# EasyEDA Pro project evenVCO.eprj, board PCB1
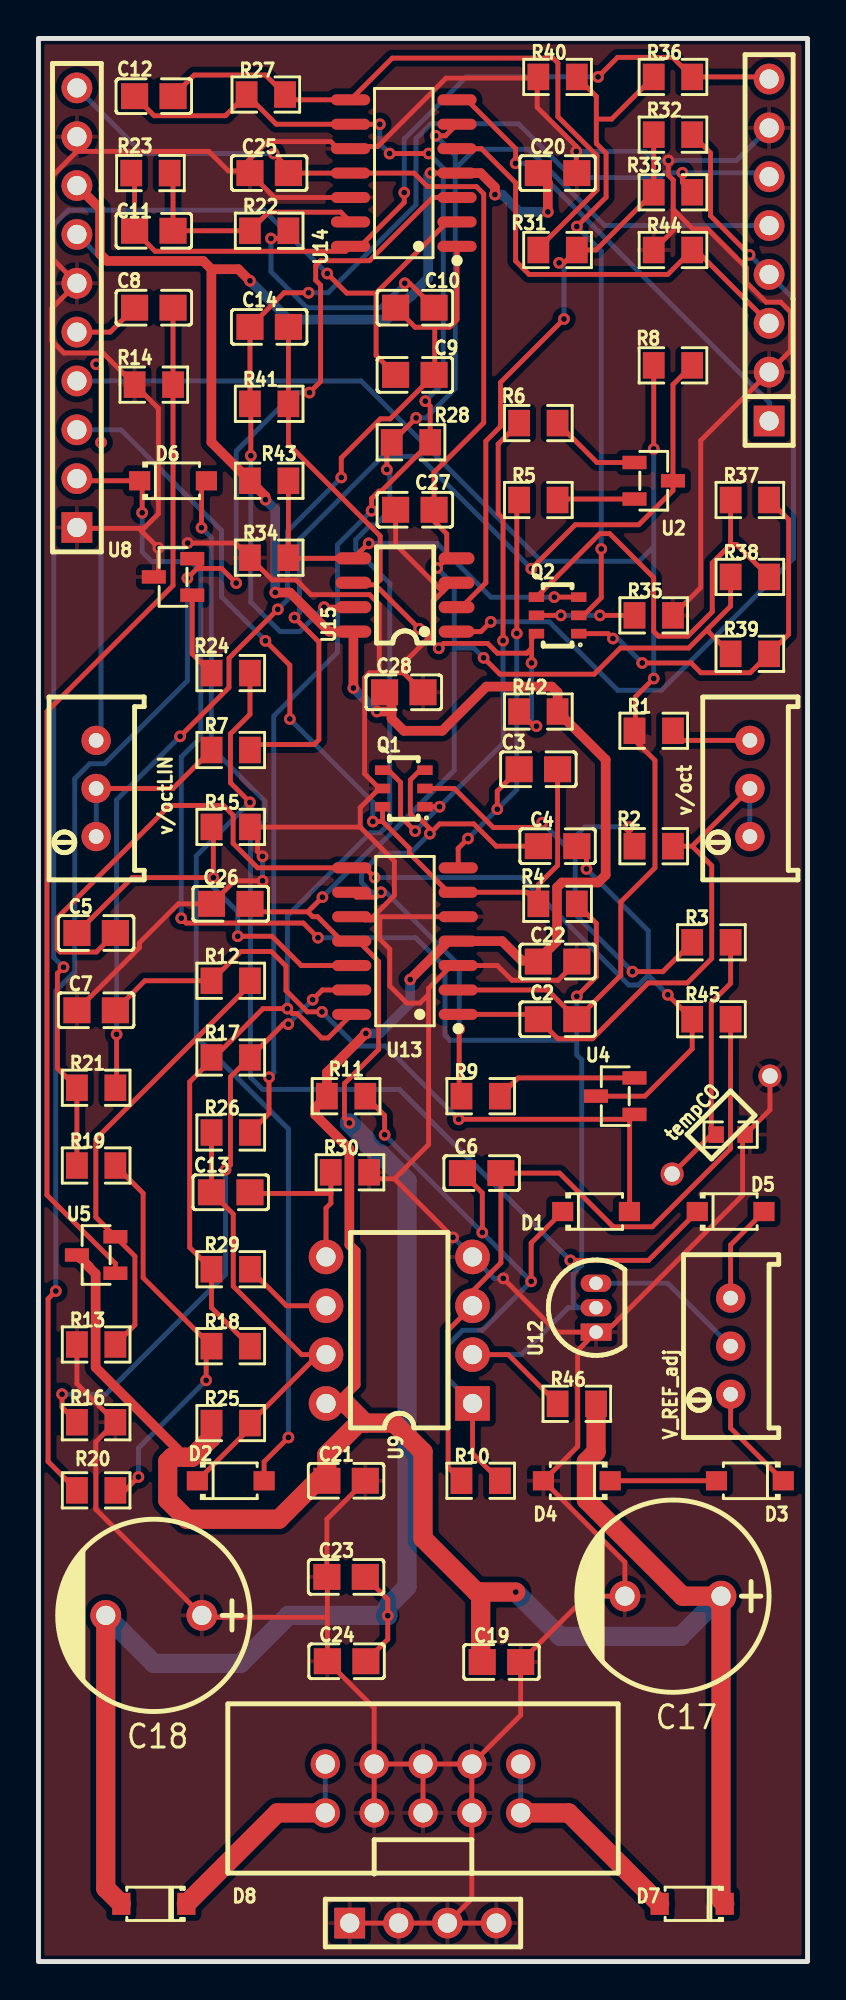
[diagram p6: board, top side]
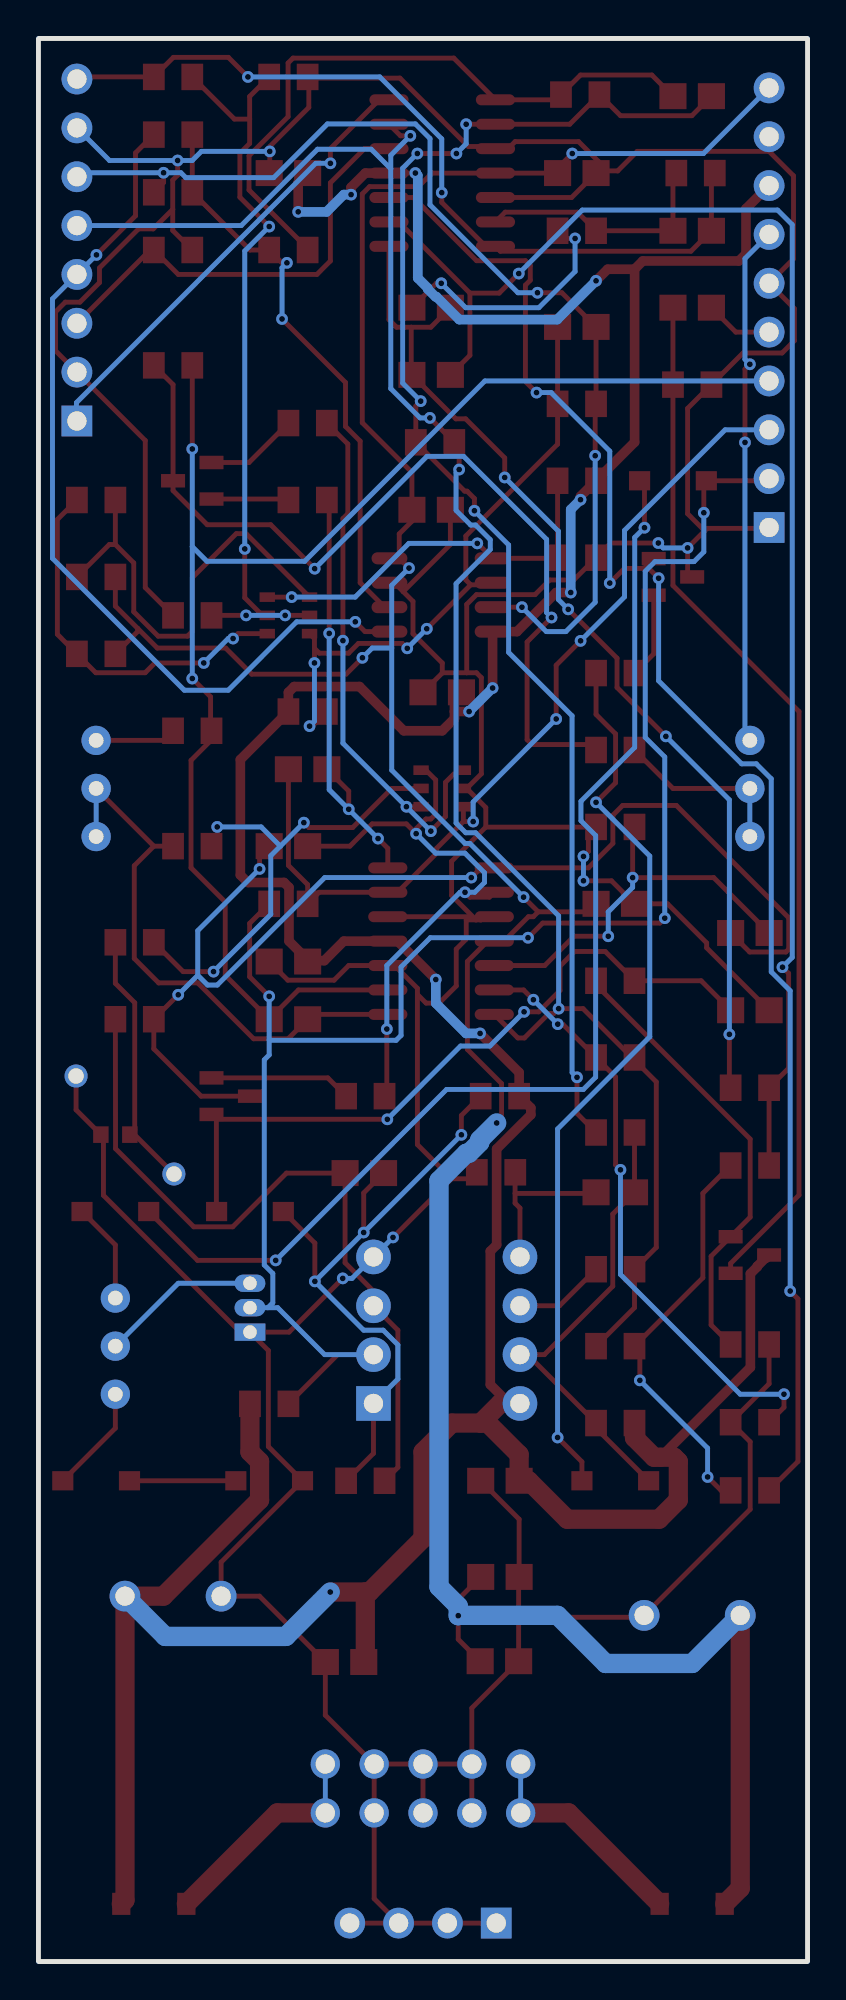
[diagram p7: board, bottom side, seen from below]

Outline 40 x 100 mm; copper layers: Top Layer, Bottom Layer. Coordinates in mm from the lower left corner of the outline.
Outline path: rectangle 0,100 40,0
Stack: Top Layer 0.035mm / Dielectric1 1.51mm FR4 er 4.5 / Bottom Layer 0.035mm

## Design rules (mm)
template: JLCPCB Capability(Two Layers Board)
spacing copperThickness1oz (default): track to track 0.102, other pairs 0.152 to 0.3
spacing copperThickness2oz: track to track 0.203, other pairs 0.152 to 0.3
track width copperThickness1oz (default): min 0.127, default 0.254, max 2.54
track width copperThickness2oz: min 0.203, default 0.254, max 2.54
differential pair differentialPair (default): width min 0.127, default 0.254, max 2.54; gap min 0.152, default 0.152
via viaSize (default): diameter min 0.5, default 0.61, max 10; hole min 0.3, default 0.305, max 6.3

## Placement (name value [footprint] x y rotation side)
C2  10nF  [C0805]  27 49 0 top
C3  1nF  [C0805]  26 62 0 top
C4  2.2nF styrene  [C0805]  27 58 0 top
C5  680nF polyester  [C0805]  3 53.48 0 top
C6  47pF  [C0805]  23.05 41 0 top
C7  47pF  [C0805]  3 49.47 0 top
C8  1nF  [C0805]  6 86 0 top
C9  3pF  [C0805]  19.58 82.51 0 top
C10  680nF  [C0805]  19.58 86 0 top
C11  10pF  [C0805]  6 90 180 top
C12  10pF  [C0805]  6 97 180 top
C13  10pF  [C0805]  10 40 180 top
C14  2.2nF  [C0805]  12 85 0 top
C17  10uF  [CAP-TH_BD10.0-P5.00-D1.0-FD-H16.0]  33 19 180 top
C18  10uF  [CAP-TH_BD10.0-P5.00-D1.0-FD-H16.0]  6 18 180 top
C19  100nF  [C0805]  24.08 15.58 0 top
C20  100nF  [C0805]  27 93 0 top
C21  100nF  [C0805]  16 25 0 top
C22  100nF  [C0805]  27 52 0 top
C23  100nF  [C0805]  16 20 0 top
C24  100nF  [C0805]  16.03 15.62 0 top
C25  100nF  [C0805]  12 93 0 top
C26  100nF  [C0805]  10 55 0 top
C27  100nF  [C0805]  19.58 75.49 0 top
C28  100nF  [C0805]  19 66 0 top
D1  1N4148W  [SOD-123F_L2.7-W1.6-LS3.8-RD]  29 39 0 top
D2  1N4148W  [SOD-123F_L2.7-W1.6-LS3.8-RD]  10 25 0 top
D3  1N4148W  [SOD-123F_L2.7-W1.6-LS3.8-RD]  37 25 180 top
D4  1N4148W  [SOD-123F_L2.7-W1.6-LS3.8-RD]  28 25 180 top
D5  1N4148W  [SOD-123F_L2.7-W1.6-LS3.8-RD]  36 39 0 top
D6  1N4148W  [SOD-123F_L2.7-W1.6-LS3.8-RD]  7 77 0 top
D7  1N5817W  [SOD-123_L2.8-W1.8-LS3.7-RD]  34 3 180 top
D8  1N5817W  [SOD-123_L2.8-W1.8-LS3.7-RD]  6 3 180 top
H1  HTSW-110-07-G-S  [HDR-TH_TSW-110-17-F-S-LL]  2 86 90 top
H2  HTSW-108-22-T-S  [HDR-TH_HTSW-108-22-T-S]  38 89 90 top
H3  HTSW-104-18-F-S  [HDR-TH_HTSW-104-25-S-S-LL]  20 2 180 top
P1  power  [IDC-TH_10P-P2.54_C5665]  20 9 0 top
Q1  BCM847DS,115  [SC-74-6_L2.9-W1.5-P0.95-LS2.8-BR]  19 61 0 top
Q2  BCM847DS,115  [SC-74-6_L2.9-W1.5-P0.95-LS2.8-BR]  27 70 0 top
R1  95.3k  [R0805]  32 64 0 top
R2  6.2k  [R0805]  32 58 180 top
R3  4.22R  [R0805]  35 53 0 top
R4  820k  [R0805]  27 55 0 top
R5  1.5k  [R0805]  26 76 0 top
R6  1.5k  [R0805]  26 80 180 top
R7  510R  [R0805]  10 63 0 top
R8  150k  [R0805]  33 83 180 top
R9  270R  [R0805]  23 45 0 top
R10  330k  [R0805]  23 25 0 top
R11  22k  [R0805]  16 45 180 top
R12  22k  [R0805]  10 51 0 top
R13  100k  [R0805]  3 32.09 0 top
R14  47k  [R0805]  6 82 0 top
R15  2M  [R0805]  10 59 0 top
R16  100k  [R0805]  3 28.04 0 top
R17  100k  [R0805]  10 47.01 0 top
R18  10K  [R0805]  10 32 0 top
R19  82k  [R0805]  3 41.39 0 top
R20  100K  [R0805]  3 24.5 0 top
R21  100k  [R0805]  3 45.44 0 top
R22  100k  [R0805]  12 90 0 top
R23  200k  [R0805]  5.82 93 0 top
R24  220k  [R0805]  10 67 180 top
R25  2.2k  [R0805]  10 28 0 top
R26  430k  [R0805]  10 43.11 0 top
R27  220k  [R0805]  11.82 97.08 0 top
R28  100k  [R0805]  19.37 79 0 top
R29  100k  [R0805]  10 36 0 top
R30  100k  [R0805]  16.2 41.04 0 top
R31  22k  [R0805]  27 89 180 top
R32  10K  [R0805]  33 95 0 top
R33  20k  [R0805]  33 92 0 top
R34  10K  [R0805]  12 73 0 top
R35  1k  [R0805]  32 70 0 top
R36  22k  [R0805]  33 98 0 top
R37  390  [R0805]  37 76 0 top
R38  43k  [R0805]  37 72 0 top
R39  43k  [R0805]  37 68 0 top
R40  1k  [R0805]  27 98 0 top
R41  10K  [R0805]  12 81 0 top
R42  10K  [R0805]  26 65 0 top
R43  10K  [R0805]  12 77 0 top
R44  100k  [R0805]  33 89 0 top
R45  10K  [R0805]  35 49 0 top
R46  1k  [R0805]  28 29 0 top
RTemp  10kΩ  [RES-TH_BD1.8-L3.2-P7.20-D0.4]  35.5 43.5 45 top
tempCO  100R_3500ppm  [R0603]  36 43 0 top
U2  2N3906(ZA)PNP  [SOT-23-3_L2.9-W1.3-P0.95-LS2.4-BR]  32 77 180 top
U4  2N3904S(ZC)NPN  [SOT-23-3_L2.9-W1.3-P0.95-LS2.4-BR]  30 45 0 top
U5  2N3904S(ZC)NPN  [SOT-23-3_L2.9-W1.3-P0.95-LS2.4-BR]  3 36.74 0 top
U8  2N3904S(ZC)NPN  [SOT-23-3_L2.9-W1.3-P0.95-LS2.4-BR]  7 72 0 top
U9  LM393N  [DIP-8_L9.7-W6.4-P2.54-LS7.6-BL]  18.77 32.83 90 top
U12  LM336  [TO-92-3_L4.9-W3.7-P1.27-L]  29 34 90 top
U13  TL084CDR  [SOIC-14_L8.7-W3.9-P1.27-LS6.0-BL]  19.06 53.06 90 top
U14  TL084CDR  [SOIC-14_L8.7-W3.9-P1.27-LS6.0-BL]  19 93 90 top
U15  TL082  [SOP-8_L4.9-W3.9-P1.27-LS6.0-BL]  19.06 71.06 90 top
v/oct  10kΩ  [RES-ADJ-TH_3P-L10.0-W10.0-P2.50-L]  37 61 90 top
v/octLIN  1kΩ  [RES-ADJ-TH_3P-L10.0-W10.0-P2.50-L]  3 61 90 top
V_REF_adj  10kΩ  [RES-ADJ-TH_3P-L10.0-W10.0-P2.50-L]  36 32 90 top

## Footprints (pads in the part's own frame, mm; a bottom-side part is the same pattern mirrored in y, then rotated)
C0805
  rect 1.41x1.35 smd: 1(-1,0) 2(1,0)
CAP-TH_BD10.0-P5.00-D1.0-FD-H16.0
  round 1.6 hole 1: 1(-2.5,0) 2(2.5,0)
DIP-8_L9.7-W6.4-P2.54-LS7.6-BL
  rect 1.8x1.8 hole 1: 1(-3.81,-3.81)
  round 1.8 hole 1: 2(-1.27,-3.81) 3(1.27,-3.81) 4(3.81,-3.81) 5(3.81,3.81) 6(1.27,3.81) 7(-1.27,3.81) 8(-3.81,3.81)
HDR-TH_HTSW-104-25-S-S-LL
  rect 1.6x1.6 hole 1: 1(3.81,0)
  round 1.6 hole 1: 2(1.27,0) 3(-1.27,0) 4(-3.81,0)
HDR-TH_HTSW-108-22-T-S
  rect 1.6x1.6 hole 1: 1(-8.89,0)
  round 1.6 hole 1: 2(-6.35,0) 3(-3.81,0) 4(-1.27,0) 5(1.27,0) 6(3.81,0) 7(6.35,0) 8(8.89,0)
HDR-TH_TSW-110-17-F-S-LL
  rect 1.6x1.6 hole 1: 1(-11.43,0)
  round 1.6 hole 1: 2(-8.89,0) 3(-6.35,0) 4(-3.81,0) 5(-1.27,0) 6(1.27,0) 7(3.81,0) 8(6.35,0) 9(8.89,0) 10(11.43,0)
IDC-TH_10P-P2.54_C5665
  round 1.524 hole 1: 1(-5.08,-1.27) 2(-5.08,1.27) 3(-2.54,-1.27) 4(-2.54,1.27) 5(0,-1.27) 6(0,1.27) 7(2.54,-1.27) 8(2.54,1.27) 9(5.08,-1.27) 10(5.08,1.27)
R0603
  rect 0.806x0.864 smd: 1(-0.753,0) 2(0.753,0)
R0805
  rect 1.133x1.377 smd: 1(-1,0) 2(1,0)
RES-ADJ-TH_3P-L10.0-W10.0-P2.50-L
  round 1.524 hole 0.762: 1(-2.5,0) 2(0,0) 3(2.5,0)
RES-TH_BD1.8-L3.2-P7.20-D0.4
  round 1.2 hole 0.8: 1(-3.6,0) 2(3.6,0)
SC-74-6_L2.9-W1.5-P0.95-LS2.8-BR
  rect 0.8x0.5 smd: 1(1.1,-0.95) 2(1.1,0) 3(1.1,0.95) 4(-1.1,0.95) 5(-1.1,0) 6(-1.1,-0.95)
SOD-123_L2.8-W1.8-LS3.7-RD
  rect 0.95x1.15 smd: 1(-1.692,0) 2(1.692,0)
SOD-123F_L2.7-W1.6-LS3.8-RD
  rect 1.1x1 smd: 1(-1.735,0) 2(1.735,0)
SOIC-14_L8.7-W3.9-P1.27-LS6.0-BL
  oval 0.574x2.038 smd: 1(-3.81,-2.769) 2(-2.54,-2.769) 3(-1.27,-2.769) 4(0,-2.769) 5(1.27,-2.769) 6(2.54,-2.769) 7(3.81,-2.769) 8(3.81,2.769) 9(2.54,2.769) 10(1.27,2.769) 11(0,2.769) 12(-1.27,2.769) 13(-2.54,2.769) 14(-3.81,2.769)
SOP-8_L4.9-W3.9-P1.27-LS6.0-BL
  oval 0.63x1.865 smd: 1(-1.905,-2.683) 2(-0.635,-2.683) 3(0.635,-2.683) 4(1.905,-2.683) 5(1.905,2.683) 6(0.635,2.683) 7(-0.635,2.683) 8(-1.905,2.683)
SOT-23-3_L2.9-W1.3-P0.95-LS2.4-BR
  rect 1.25x0.7 smd: 1(1,-0.95) 2(1,0.95) 3(-1,0)
TO-92-3_L4.9-W3.7-P1.27-L
  rect 0.9x1.6 hole 0.7: 1(-1.27,0)
  oval 0.9x1.6 hole 0.7: 2(0,0) 3(1.27,0)

## Nets
As in the schematic.

## Via types
v1: diameter 0.61, hole 0.305, Top Layer to Bottom Layer, 115 vias

## Routing (per net, layer and track width the routed paths; a pad name or vN(x,y) marks a point on that pad's centre or on a via; arc(x,y) is an arc through that point)
+12V: length 224.8
  Top Layer w0.254: 25.95,52.05 C22.1 ; C28.1 18.13,66 18.36,65.76 ; v1(20.4,93) 21.77,93
  Top Layer w0.5: 9,88 8.99,88 8.99,79.01 R43.1 11.81,76.19 v1(11.81,76.02) ; 9,88 10.4,88 v1(11,87.4) ; 9,88 8.57,88.43 3.57,88.43 3.2,88.8 3.2,91.15 H1.8 ; v1(23.74,91.88) 23.74,92.26 23,93 U14.4 ; 18.36,65 18.36,65.76 ; 18.36,65 18.36,64.64 19,64 21,64 23.3,66.3 26.7,66.3 27,66 R42.2 29.5,62.5 29.5,56.5 29.11,56.11 27.22,56.11 26.97,55.86 26.97,53.06 25.95,52.05 25.13,52.05 24.12,53.06 U13.4 21.32,53.06 19.33,51.07 v1(19.33,51.06) ; 18.36,65 v1(17.6,65) ; 7.65,26.22 2.97,30.89 2.97,35.77 2.61,36.13 2.61,36.16 2.2,36.57 2.17,36.57 U5.3 ; C20.1 26.49,92.51 v1(26.49,90.98) ; v1(17.03,48.26) 15,46.23 R11.2 14.39,44.39 14.39,44.03 16.17,42.25 16.17,37.27 16.5,36.94 16.5,30 15.52,29.02 U9.8 ; v1(12.32,71.19) 13.08,71.19 15.11,69.16 U15.8 v1(16.38,66.22)
  Top Layer w1: C19.1 23,15.66 23,19.21 ; 15.52,29.02 15.98,29.02 17,28 ; R46.2 29,26.5 28.5,26 28.5,24 33.5,19 C17.1 35.5,3.19 D7.1 ; 17,28 18.5,28 20,26.5 20,22 22.79,19.21 23,19.21 ; 17,28 16.64,28 15,26.36 C21.1 14.5,25 12.5,23 7.72,23 6.72,24 6.72,26 6.94,26.22 7.98,26.22 9,27.24 R25.1 ; 23,19.21 v1(24.82,19.21)
  Bottom Layer w0.5: v1(17.6,65) v1(16.38,66.22) ; v1(12.32,71.19) 12.32,75.51 v1(11.81,76.02) ; v1(26.49,90.98) 25.02,90.98 24.12,91.88 v1(23.74,91.88) ; v1(20.4,93) 20.27,92.88 20.27,87.54 19.76,87.03 19.76,86.98 19.34,86.56 19.29,86.56 18.11,85.38 13.02,85.38 v1(11,87.4) ; v1(19.33,51.06) 19.33,49.83 17.76,48.26 v1(17.03,48.26)
  Bottom Layer w1: C17.1 33.41,16.91 27.13,16.91 v1(24.82,19.21)
-12V: length 168.3
  Top Layer w0.254: 34.84,69.32 34.84,69.17 R39.1 ; 34.84,69.32 36,70.48 R38.1 ; 34.84,69.32 33.82,68.3 30.26,68.3 28.9,66.94 24,66.94 v1(23.15,67.79) ; C26.2 11.41,54.59 14.01,54.59 ; v1(16.17,43.61) 15.91,43.86 15.91,45.65 17.69,47.43 17.69,52 16.63,53.06 U13.11 15.78,53.06 14.51,54.33 14.26,54.33 14.01,54.59 ; C24.2 18.17,16.76 v1(18.17,17.98) 18.17,18.83 C23.2 ; 21.24,72.97 21.24,74.24 20.58,74.9 C27.2 20.58,77.44 23.16,80.02 23.16,91.92 22.78,92.3 20.24,92.3 19.53,93 U14.11 C25.2 13,93.25 v1(12.24,94.02) ; 21.24,72.97 U15.4 ; 21.24,72.97 v1(20.73,72.46) ; 14.01,54.59 v1(14.77,55.35)
  Top Layer w1: C18.2 3.5,3.81 D8.2
  Bottom Layer w0.254: H1.10 5.41,94.02 v1(12.24,94.02) ; 21.63,68.3 21.63,61.95 17.82,58.14 17.56,58.14 v1(14.77,55.35) ; 21.63,68.3 22.64,68.3 v1(23.15,67.79) ; 21.63,68.3 21.63,71.56 v1(20.73,72.46)
  Bottom Layer w1: C18.2 6,15.5 10.5,15.5 13,18 18.15,18 v1(18.17,17.98) 18.17,18.48 19.17,19.48 19.17,40.61 17.74,42.03 17.61,42.03 17.05,42.59 17.05,42.73 v1(16.17,43.61)
GND: length 343.1
  Top Layer w0.254: 17.24,54.17 18.51,55.44 18.51,57.21 16.73,58.99 ; 17.24,54.17 16.99,54.17 16.82,54.33 U13.10 ; 17.24,54.17 17.75,54.17 ; P1.4 P1.3 ; P1.4 P1.6 ; P1.4 17.46,13.18 C24.1 15.03,17.9 ; U12.1 29.51,32.73 36.62,39.84 36.62,42.87 38.04,44.29 RTemp.2 ; U12.1 26.97,32.73 v1(24.17,35.52) ; U12.1 28.04,31.77 28.04,26.78 D4.2 30.5,20.76 C17.2 28.5,19 C19.2 25.08,12.81 P1.8 ; v1(11.65,56.2) 10.2,56.2 C26.1 7.28,55 5.25,52.97 5.25,52.71 C7.1 ; 10.89,93.11 10.89,93.62 11.91,94.64 15.21,94.64 15.46,94.38 16.12,94.38 ; 10.89,93.11 9.87,93.11 8.86,94.13 2,94.13 ; 10.89,93.11 C25.1 12.27,91.73 U14.12 ; H3.3 22.54,3.27 P1.7 P1.8 ; H3.3 H3.4 ; H3.3 H3.2 H3.1 ; U8.3 6.24,72.24 v1(6.24,73.51) 5.22,74.52 ; C28.2 19,67 18.99,67.02 17.73,67.02 ; 19,67.02 19,67.52 20.52,69.05 20.52,70.73 21.03,71.24 ; v1(7.76,73.76) 10.24,73.76 R34.1 12.16,71.84 13.41,71.84 14.17,71.08 17.22,71.08 17.73,70.57 17.73,67.02 ; 33.02,91.11 34.03,90.1 34.79,90.1 36.83,88.07 36.83,87.3 37.84,86.29 38.6,86.29 39.11,85.78 39.11,83.76 H2.2 34.44,79.09 34.44,71.44 R35.2 ; 33.02,91.11 33.02,90.02 R44.1 ; 33.02,91.11 33.02,92.64 32.76,92.89 v1(32.76,93.65) ; P1.6 P1.8 ; P1.6 P1.5 ; 16.12,94.38 U14.10 ; 16.12,94.38 17.64,94.38 21.2,97.94 25.94,97.94 ; 17.73,67.02 17.22,67.02 16.97,66.76 16.97,61.76 17.73,61 ; 17.73,61 16.73,60.01 16.73,58.99 ; 17.73,61 Q1.5 ; 25.94,97.94 25.94,96.41 27.97,94.38 27.97,93.03 C20.2 ; 25.94,97.94 R40.1 ; R15.2 11.01,58.99 11.4,58.99 ; 20.29,50.29 20.29,50.61 21.47,51.79 U13.3 23.86,51.79 24.62,51.03 27.03,51.03 C22.2 ; 20.29,50.29 19.84,49.84 19.16,49.84 18.27,50.73 18.27,52.65 17.75,53.17 17.75,54.17 ; 20.29,50.29 20.29,42.48 18.51,40.7 ; U15.3 21.49,71.7 21.03,71.24 ; 16.73,58.99 11.4,58.99 ; 11.4,58.99 11.4,57.72 v1(11.65,57.47) ; H1.1 2.05,74.52 5.22,74.52 ; 2,94.13 0.73,92.86 0.73,88.54 H1.6 0.68,85.95 0.68,84.29 1.32,83.64 3.36,83.64 R14.1 6.24,80.76 6.24,75.29 5.48,74.52 5.22,74.52 ; 2,94.13 H1.9 ; 18.51,40.7 17.54,40.7 R30.2 ; 18.51,40.7 v1(21.56,37.66) ; U13.5 17.58,54.33 17.75,54.17 ; C27.1 18.58,73.69 21.03,71.24 ; 15.03,17.9 8.6,17.9 C18.1 2.98,23.52 2.98,27.03 R16.2 2,30.04 R13.1 ; 15.03,17.9 15.03,19.97 C23.1 15,23 C21.2
  Bottom Layer w0.254: v1(21.56,37.66) U9.4 23.69,35.52 v1(24.17,35.52) ; v1(11.65,57.47) v1(11.65,56.2) ; v1(7.76,73.76) 7.51,73.51 v1(6.24,73.51) ; v1(27.97,94.13) 31.53,94.13 32,93.65 v1(32.76,93.65) 36.3,93.65 H2.7
-V_REF: length 27.1
  Top Layer w0.254: v1(3,83.06) 3.25,82.8 v1(3.25,78.99)
  Bottom Layer w0.254: v/octLIN.3 3.25,63.75 v1(3.25,78.99) ; v1(3,83.06) 3.25,83.31 3.25,88.56 H1.7
EVEN_OUT: length 46.3
  Top Layer w0.254: v1(36.98,88.75) 34.95,90.78 34.95,94.05 R32.2 ; v1(23.52,69.67) 23.01,69.16 U15.1
  Bottom Layer w0.254: v1(23.52,69.67) 26.57,69.67 30.13,66.11 32.41,66.11 39.27,72.97 39.27,86.46 H2.4 v1(36.98,88.75)
FM_IN: length 46.8
  Top Layer w0.254: 17.9,59.28 19.29,57.89 19.29,57.63 21.32,55.6 U13.6 25.4,55.6 R4.1 26,56 27,57 C3.2 ; 17.9,59.28 v1(17.39,59.28) ; 17.9,59.28 Q1.6 ; v1(13.07,64.61) 13.07,67.41 v1(11.8,68.68)
  Bottom Layer w0.254: H1.3 4.29,79.65 9.52,74.42 9.52,70.96 v1(11.8,68.68) ; v1(13.07,64.61) 17.39,60.3 v1(17.39,59.28)
PW_IN: length 23.4
  Top Layer w0.254: H2.3 34.19,89 R44.2 32.73,87.73 25.51,87.73 24.82,88.43 24.82,92.49 23.04,94.27 U14.5
PW_OUT: length 24.2
  Top Layer w0.254: v1(24.82,93.51) 24.82,94.27 22.28,96.81 U14.7
  Bottom Layer w0.254: H2.1 38.03,80.14 38.03,81.06 25.58,93.51 v1(24.82,93.51)
SAW_OUT: length 97.8
  Top Layer w0.254: v1(20.66,94.94) 21.17,94.94 U14.6 ; 9.14,47.01 11.68,49.55 v1(12.95,49.55) 13.2,49.3 13.45,49.3 14.72,48.03 15.07,48.03 U13.14 ; 9.14,47.01 7.87,45.74 7.87,37.13 R29.1 9,34 R18.2 ; 9.14,47.01 R17.1 ; v1(19.64,80.27) R28.1 18.12,78.75 v1(18.12,77.58)
  Bottom Layer w0.254: 21.68,93.22 22.69,94.24 25.49,94.24 29.45,90.27 H2.5 ; 21.68,93.22 21.68,93.92 v1(20.66,94.94) ; 21.68,93.22 21.68,81.79 20.15,80.27 v1(19.64,80.27) ; v1(12.95,49.55) 12.95,54.38 17.26,58.69 17.77,58.69 18.28,59.2 18.28,71.65 16.5,73.43 16.5,73.94 17.26,74.7 17.52,74.7 18.28,75.46 18.28,77.42 v1(18.12,77.58)
SIN_OUT: length 56.8
  Top Layer w0.254: v1(14.05,86.78) 12.78,86.78 C14.1 R41.1 11.05,80.95 v1(11.05,78.3) ; R33.2 33.49,92.51 v1(33.49,93.02) ; 16.38,70.43 v1(14.86,70.43)
  Bottom Layer w0.254: H2.6 37.79,93.02 v1(33.49,93.02) 32.59,93.02 32.34,92.76 27.76,92.76 24.97,95.56 20.4,95.56 19.64,94.79 19.64,91.35 15.06,86.78 v1(14.05,86.78) ; v1(11.05,78.3) 11.05,70.68 12.57,69.16 13.59,69.16 v1(14.86,70.43)
SYNC: length 3.5
  Top Layer w0.254: C8.1 3.73,84.73 H1.5
TRI_OUT: length 43.1
  Top Layer w0.254: v1(19.03,91.98) 19.03,91.48 16.74,89.19 U14.14 15.98,88.94 6.06,88.94 C11.2 5,92.82 R23.1 ; v1(29.1,98) 30.12,99.02 32.98,99.02 R36.2 37.89,98 H2.8
  Bottom Layer w0.254: v1(29.1,98) 22.25,98 19.03,94.78 v1(19.03,91.98)
V_OCT_IN: length 77.5
  Top Layer w0.254: 31.05,63.99 R1.1 ; 31.05,63.99 31.05,63.48 32.06,62.46 32.06,56.87 30.29,55.1 30.29,51.29 C2.2 26.48,50.52 U13.2 ; 31.05,63.99 31.05,65.76 v1(32,66.72) ; v1(32,78.65) R8.2
  Bottom Layer w0.254: 32,73.57 v1(32,78.65) ; 32,73.57 v1(32,66.72) ; 32,73.57 31.24,72.81 26.16,72.81 16.78,82.19 H1.4
V_REF: length 89.4
  Top Layer w0.254: v1(7.43,54.25) 7.68,54 13.78,54 v1(14.54,53.24) ; R46.1 24.44,31.56 U9.2 ; H1.2 2.11,77 D6.1 5.39,76.87 v1(5.39,75.34) ; v1(28,50.19) 29.02,51.21 29.02,53.98 R4.2
  Bottom Layer w0.254: 28,47.91 21.4,47.91 21.14,48.16 21.14,51.72 19.62,53.24 v1(14.54,53.24) ; 28,47.91 v1(28,50.19) ; 28,47.91 28,47.14 28.25,46.89 28.25,36.22 27.81,35.78 27.81,34.25 28.06,34 ; 28.06,34 U12.2 ; 28.06,34 27.56,34 25.12,31.56 U9.2 ; v1(7.43,54.25) 7.43,62.64 8.44,63.65 8.44,72.29 7.93,72.8 5.9,72.8 5.39,73.31 v1(5.39,75.34)
$1N507: length 4.2
  Top Layer w0.254: R1.2 33.5,63.5 v/oct.3
$1N1389: length 23
  Top Layer w0.254: v1(24.88,69.06) 24.88,75.88 R5.1 ; v1(22.34,58.4) 21.83,57.89 U13.7 ; C3.1 23.86,60.86 v1(23.86,59.92)
  Bottom Layer w0.254: v1(24.88,69.06) 24.88,60.94 v1(23.86,59.92) v1(22.34,58.4)
$1N1507: length 4
  Top Layer w0.254: U2.2 27.05,76.05 R5.2
$1N1586: length 4.8
  Top Layer w0.254: U2.1 29.05,77.95 R6.1
$1N1640: length 47.1
  Top Layer w0.254: v1(13.32,69.89) 14.59,68.62 14.59,63.54 14.33,63.28 11.28,63.28 R7.2 ; v1(25.63,72.43) 27.92,74.71 31.22,74.71 33,76.49 U2.3 33,82 R8.1
  Bottom Layer w0.254: v1(13.32,69.89) 13.57,70.14 13.57,73.95 17.89,78.27 19.79,78.27 v1(25.63,72.43)
$1N1719: length 9.3
  Top Layer w0.254: v/octLIN.2 7,61 R7.1
  Bottom Layer w0.254: v/octLIN.2 v/octLIN.1
$1N2016: length 31
  Top Layer w0.254: U13.9 16.55,55.35 17.56,55.35 v1(17.82,55.6) ; C4.1 23.8,58 22.64,59.16 20.87,59.16 v1(20.36,58.65) 20.36,58.9 19.85,59.41 19.59,59.41 19.34,59.67 19.34,61.44 19.85,61.95 Q1.3 ; v1(21.88,48.49) 21.88,45.12 R9.1
  Bottom Layer w0.254: v1(20.36,58.65) 19.34,57.63 17.82,57.63 16.8,56.62 16.8,56.11 17.31,55.6 v1(17.82,55.6) 18.07,55.6 21.88,51.79 v1(21.88,48.49)
$1N2204: length 7.4
  Top Layer w0.254: R9.2 24.95,45.95 U4.2
$1N2447: length 34.9
  Top Layer w0.254: v1(23.08,37.91) 23.08,39.97 C6.1 ; v1(18,42.99) 18,44 R11.1 ; R10.2 22.58,26.42 U9.1 ; v1(25.62,35.37) 25.62,37.36 D1.1
  Bottom Layer w0.254: v1(18,42.99) v1(23.08,37.91) v1(25.62,35.37) 23.08,32.83 22.07,32.83 21.31,32.07 21.31,30.29 U9.1
$1N2683: length 21.1
  Top Layer w0.254: v1(10.37,53.32) 12.14,53.32 13.67,51.79 U13.12 ; R15.1 9.1,58.9 v1(9.1,56.36) 4.88,56.36 C5.1
  Bottom Layer w0.254: v1(10.37,53.32) 10.37,54.59 9.1,55.86 v1(9.1,56.36)
$1N2690: length 13.7
  Top Layer w0.254: R3.2 36,50.87 34.99,49.86 34.99,43.25 tempCO.1 35,43 RTemp.1
$1N2936: length 28.5
  Top Layer w0.254: v1(24.16,68.69) 24.16,75.04 23.91,75.29 23.91,78.91 R6.2 ; v1(19.59,58.78) 18.83,59.54 18.83,61.32 18.2,61.95 Q1.4 ; Q1.1 v1(20.86,60.05)
  Bottom Layer w0.254: v1(24.16,68.69) 24.16,63.35 v1(20.86,60.05) v1(19.59,58.78)
$1N2959: length 25.3
  Top Layer w0.254: Q1.2 21.62,61 23.66,58.97 25.94,58.97 v1(26.2,59.22) ; v1(30.89,51.48) 32.48,51.48 R3.1 ; R2.2 30.7,58.3 v1(30.7,59)
  Bottom Layer w0.254: 27.42,58 27.92,57.5 27.92,54.45 v1(30.89,51.48) ; 27.42,58 28.42,59 v1(30.7,59) ; 27.42,58 v1(26.2,59.22)
$1N3105: length 37.5
  Top Layer w0.254: v1(14.74,49.38) 13.98,49.38 12.87,50.49 12.87,51.76 12.11,52.52 10.52,52.52 R12.1 5.53,51 C7.2 ; U4.1 30.75,43.8 ; 30.75,43.8 v1(21.86,43.8) ; 30.75,43.8 30.75,39.01 D1.2
  Bottom Layer w0.254: v1(21.86,43.8) 18.05,47.61 16.52,47.61 v1(14.74,49.38)
$1N3116: length 62.4
  Top Layer w0.254: 16.47,56.87 16.98,56.87 v1(17.49,56.37) ; 16.47,56.87 U13.8 ; 16.47,56.87 11.39,56.87 10.12,58.14 10.12,59.61 9.62,60.12 6.82,60.12 0.98,54.27 0.98,52.64 1.13,52.5 3.01,52.5 C5.2 ; C4.2 28.5,57.5 v1(28.5,56.82) ; U4.3 31.54,45 34,47.46 R45.1 v1(32.73,50.27)
  Bottom Layer w0.254: 31.71,51.29 31.71,53.6 v1(28.5,56.82) ; 31.71,51.29 v1(32.73,50.27) ; 31.71,51.29 31.21,50.78 30.7,50.78 25.11,56.37 v1(17.49,56.37)
$1N3938: length 54.4
  Top Layer w0.254: C8.2 R14.2 7,71.56 0.44,65 0.44,39.85 4,36.3 U5.1
$1N3981: length 23.5
  Top Layer w0.254: R12.2 11,50.79 2.98,42.77 2.98,38.71 U5.2 5.02,36.67 5.02,33.1 R13.2
$1N4358: length 31.4
  Top Layer w0.254: v1(12.99,48.74) 12.73,48.74 R17.2 9.98,46 9.98,41.42 v1(9.73,41.17) ; U13.13 14.77,50.52 v1(14.26,50.01) ; R16.1 1.23,28.82 v1(1.23,29.5)
  Bottom Layer w0.254: v1(1.23,29.5) 3.5,29.5 9.73,35.73 v1(9.73,41.17) ; v1(14.26,50.01) v1(12.99,48.74)
$1N4747: length 83
  Top Layer w0.254: v1(14.1,81.59) 14.67,82.16 14.67,87.17 14.42,87.43 14.42,88.19 14.67,88.44 17.21,88.44 20.5,91.73 U14.3 ; 8.51,72.44 9.52,72.44 v1(10.29,71.68) ; 8.51,72.44 8.25,72.44 v1(7.75,71.93) ; 8.51,72.44 U8.2 ; R20.1 0.5,26 0.5,34.46 v1(0.9,34.87)
  Bottom Layer w0.254: v1(14.1,81.59) 13.33,81.59 10.29,78.54 v1(10.29,71.68) ; v1(0.9,34.87) 0.9,50.48 1.89,51.47 1.89,61.5 2.67,62.28 3.43,62.28 7.75,66.6 v1(7.75,71.93)
$1N4955: length 21.3
  Top Layer w0.254: v1(5.2,25.2) 4.5,24.5 R20.2 ; R19.2 5.44,39.95 5.44,35.56 R18.1 8.72,31.72 v1(8.72,30.22)
  Bottom Layer w0.254: v1(8.72,30.22) 5.2,26.7 v1(5.2,25.2)
$1N5308: length 12.9
  Top Layer w0.254: R23.2 7,92.82 C11.1 R22.1 11.97,90.97 15.72,90.97 U14.13
$1N5674: length 4.5
  Top Layer w0.254: R24.2 8,68 U8.1
$1N5714: length 46.5
  Top Layer w0.254: R24.1 11,64.85 9.98,63.83 9.98,61.3 v1(11,60.28) ; D2.2 11.74,25.99 v1(13,27.25)
  Bottom Layer w0.254: v1(13,27.25) 13,43.29 8.21,48.09 8.21,57.48 v1(11,60.28)
$1N6127: length 38.9
  Top Layer w0.254: R45.2 35.99,42.27 31.93,38.21 29.89,38.21 27.1,41 C6.2 24.05,36.34 22.58,34.86 U9.3 21.31,32.83 21.31,25.69 R10.1
$1N6419: length 4.7
  Top Layer w0.254: R29.2 12.9,34.1 U9.6
$1N6424: length 8.7
  Top Layer w0.254: R30.1 15.21,41.03 15.21,39.94 ; C13.1 11.06,39.94 15.21,39.94 ; 15.21,39.94 15.21,39.43 14.96,39.18 U9.5
$1N6566: length 23.9
  Top Layer w0.254: D2.1 11,27.74 R25.2 14.56,31.56 ; R26.1 C13.2 10.13,38.87 10.13,35.12 13.69,31.56 14.56,31.56 ; 14.56,31.56 U9.7
$1N7314: length 34.3
  Top Layer w0.254: Q2.2 28.35,70 29.27,70.92 v1(29.27,73.46) ; 29.02,95.81 29.02,94.54 29.52,94.03 29.52,91.74 v1(28,90.22) ; 29.02,95.81 29.81,95.81 R36.1 ; 29.02,95.81 29.02,96.98 R40.2
  Bottom Layer w0.254: v1(29.27,73.46) 29.27,88.95 v1(28,90.22)
$1N7370: length 23.8
  Top Layer w0.254: 36,73.68 35.04,72.73 35.04,70.19 33.77,68.92 32.25,68.92 32,69.17 32,71.97 29.71,74.25 29.2,74.25 Q2.4 ; 36,73.68 R37.1 ; 36,73.68 36.32,73.68 R38.2
$1N7375: length 20
  Top Layer w0.254: R37.2 39.02,74.98 39.02,69.02 R39.2 37.02,67.02 34.45,67.02 33.94,67.53 v1(31.4,67.53) ; v1(29.88,68.8) 29.62,69.05 Q2.1
  Bottom Layer w0.254: v1(29.88,68.8) 30.13,68.8 v1(31.4,67.53)
$1N8230: length 5.6
  Top Layer w0.254: V_REF_adj.1 36,27.74 D3.1
$1N8312: length 8.4
  Bottom Layer w0.254: U12.3 32.73,35.27 V_REF_adj.2
$1N8440: length 5.5
  Top Layer w0.254: D3.2 D4.1
$1N8647: length 61
  Top Layer w0.254: v1(27.66,36.46) 31.72,36.46 D5.1 ; D6.2 8.48,76.75 v1(8.48,74.56)
  Bottom Layer w0.254: v1(8.48,74.56) 8.99,74.05 8.99,63.13 11.78,60.34 11.78,59.32 11.02,58.56 11.02,45.99 11.66,45.35 18.77,45.35 v1(27.66,36.46)
$1N8687: length 5.2
  Top Layer w0.254: V_REF_adj.3 36,37.27 D5.2
$1N9074: length 11.7
  Top Layer w1: P1.1 12.42,7.73 D8.1
  Bottom Layer w0.254: P1.1 P1.2
$1N9101: length 11.7
  Top Layer w1: D7.2 27.58,7.73 P1.9
  Bottom Layer w0.254: P1.9 P1.10
$1N9891: length 29.4
  Top Layer w0.254: U13.1 25.75,49.25 C2.1 27.02,47.98 28.81,47.98 31.71,50.89 33.75,50.89 35.02,52.16 35.02,56.98 34,58 ; 34,58 R2.1 ; 34,58 v/oct.2
  Bottom Layer w0.254: v/oct.2 v/oct.1
$1N10311: length 54.3
  Top Layer w0.254: 20.61,84.98 19.59,84.98 C10.1 ; 20.61,84.98 20.61,82.54 C9.2 18.29,80.22 17.78,80.22 15.75,78.19 v1(15.75,77.17) ; 20.61,84.98 21.37,84.98 21.77,85.38 U14.1 ; v1(12.45,70.31) 9.91,67.77 9.91,66.25 v1(7.37,63.71) ; R21.2 4.07,45.5 v1(4.07,48.22)
  Bottom Layer w0.254: v1(4.07,48.22) 4.07,60.41 v1(7.37,63.71) ; v1(12.45,70.31) 12.96,70.82 12.96,74.38 v1(15.75,77.17)
$1N10325: length 79
  Top Layer w0.254: 17.56,86.76 17.56,83.52 C9.1 ; 17.56,86.76 21.26,90.46 U14.2 ; 17.56,86.76 16.04,86.76 v1(15.02,87.78) ; R19.1 R21.1 0.98,46.45 0.98,51.39 v1(1.3,51.71)
  Bottom Layer w0.254: v1(15.02,87.78) 11.72,91.08 1.56,91.08 0.8,90.31 0.8,52.22 v1(1.3,51.71)
$1N10403: length 73.7
  Top Layer w0.254: v1(18.26,94.02) v1(20.29,94.02) ; R26.2 11.99,44.1 v1(11.99,45.98) ; v1(17.33,75.44) 17.33,76.08 17.71,76.46 17.83,76.46 R28.2 20.37,80.89 v1(20.12,81.14) ; C12.2 6.02,95.98 9.73,95.98 R27.1 12.37,95.54 U14.9 v1(17.75,95.54)
  Bottom Layer w0.254: v1(17.33,75.44) 15.55,73.67 15.55,68.08 12.25,64.78 12.25,46.23 v1(11.99,45.98) ; v1(20.29,94.02) 21.06,93.25 21.06,82.08 v1(20.12,81.14) ; v1(17.75,95.54) 17.75,94.52 v1(18.26,94.02)
$1N10523: length 13.1
  Top Layer w0.254: C10.2 19.31,87.27 v1(19.05,87.27) ; R22.2 12.6,89.6 v1(12.09,89.6)
  Bottom Layer w0.254: v1(19.05,87.27) 17.78,86 13.97,86 12.09,87.88 v1(12.09,89.6)
$1N10728: length 20.6
  Top Layer w0.254: R43.2 R34.2 13.03,72.97 U15.5 17.16,73.74 v1(17.18,73.74) ; Q2.3 v1(26.83,70.95)
  Bottom Layer w0.254: v1(26.83,70.95) 23.53,70.95 20.73,73.74 v1(17.18,73.74)
$1N10768: length 32.8
  Top Layer w0.254: Q2.6 25.65,68.8 25.65,68.29 ; C14.2 R41.2 13,78.9 17.77,74.13 17.77,71.84 17.52,71.59 ; 25.65,68.29 v1(25.65,67.53) ; 25.65,68.29 25.39,68.03 23.87,68.03 23.36,68.54 21.07,68.54 v1(20.82,68.29) ; R42.1 25.76,64.24 v1(25.9,64.24) ; 17.52,71.59 16.49,71.59 U15.6 ; 17.52,71.59 v1(19.8,69.3)
  Bottom Layer w0.254: v1(25.9,64.24) 25.65,64.49 v1(25.65,67.53) ; v1(20.82,68.29) v1(19.8,69.3)
$1N10882: length 29.9
  Top Layer w0.254: v1(27.33,85.41) 24.03,82.11 24.03,79.83 23.27,79.06 23.27,71.7 22,70.43 21.74,70.43 ; R32.1 R33.1 29,89 R31.1 27.33,88.33 v1(27.08,88.33)
  Bottom Layer w0.254: v1(27.08,88.33) 27.33,88.08 v1(27.33,85.41)
$1N10889: length 33.8
  Top Layer w0.254: R31.2 26,89.07 29.05,92.12 29.05,93.9 27.02,95.93 27.02,98.72 26.76,98.98 18.4,98.98 U14.8 13.1,96.81 R27.2 11.81,98.1 8.1,98.1 C12.1
$1N11135: length 5.1
  Top Layer w0.254: Q2.5 v1(27.17,70) ; v1(29.2,70) R35.1
  Bottom Layer w0.254: v1(27.17,70) v1(29.2,70)

## Copper pours and planes (outline as drawn; the poured copper is in the pictures)
GND on Top Layer: 0,99.5 0.01,99.61 0.06,99.74 0.15,99.85 0.26,99.94 0.39,99.99 0.5,100 39.5,100 39.61,99.99 39.74,99.94 39.85,99.85 39.94,99.74 39.99,99.61 40,99.5 40,0.5 39.99,0.39 39.94,0.26 39.85,0.15 39.74,0.06 39.61,0.01 39.5,0 0.5,0 0.39,0.01 0.26,0.06 0.15,0.15 0.06,0.26 0.01,0.39 0,0.5
